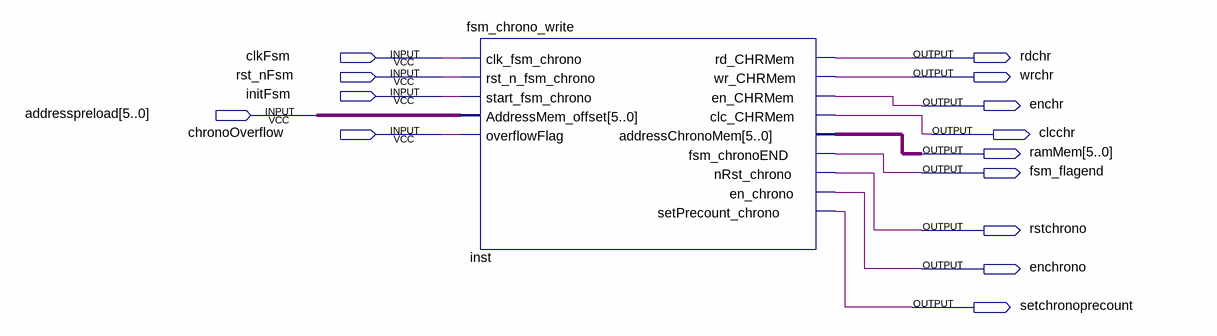
[diagram p0: schematic sheet]
// Quartus schematic fsmchorno.bdf as structural Verilog: 1 symbols, 14 pins
module fsmchorno (
  input  clkFsm,
  input  rst_nFsm,
  input  initFsm,
  input  [5:0] addresspreload,
  input  chronoOverflow,
  output rdchr,
  output wrchr,
  output enchr,
  output clcchr,
  output [5:0] ramMem,
  output fsm_flagend,
  output rstchrono,
  output enchrono,
  output setchronoprecount
);

  fsm_chrono_write inst (
    .clk_fsm_chrono(clkFsm), .rst_n_fsm_chrono(rst_nFsm), .start_fsm_chrono(initFsm),
    .AddressMem_offset(addresspreload), .overflowFlag(chronoOverflow), .rd_CHRMem(rdchr), .wr_CHRMem(wrchr),
    .en_CHRMem(enchr), .clc_CHRMem(clcchr), .addressChronoMem(ramMem), .fsm_chronoEND(fsm_flagend),
    .nRst_chrono(rstchrono), .en_chrono(enchrono), .setPrecount_chrono(setchronoprecount));
endmodule
